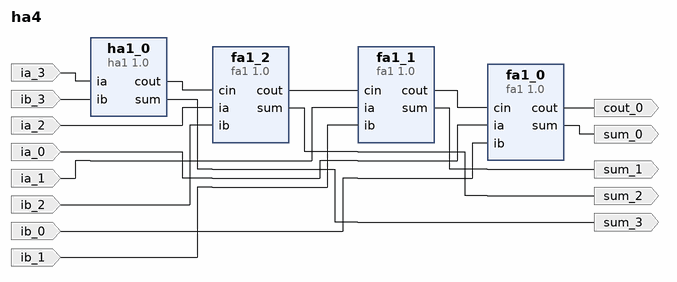
[diagram p0: block diagram of the top level]
# Vivado block design ha4, xc7z020clg484-2, Vivado 2024.1
create_bd_design ha4

create_bd_port -dir O sum_0
create_bd_port -dir O cout_0
create_bd_port -dir I ia_0
create_bd_port -dir I ib_0
create_bd_port -dir I ia_1
create_bd_port -dir I ib_1
create_bd_port -dir O sum_1
create_bd_port -dir I ia_2
create_bd_port -dir I ib_2
create_bd_port -dir O sum_2
create_bd_port -dir I ia_3
create_bd_port -dir I ib_3
create_bd_port -dir O sum_3

create_bd_cell -type ip -vlnv xilinx.com:user:fa1:1.0 fa1_0
create_bd_cell -type ip -vlnv xilinx.com:user:ha1:1.0 ha1_0
create_bd_cell -type ip -vlnv xilinx.com:user:fa1:1.0 fa1_1
create_bd_cell -type ip -vlnv xilinx.com:user:fa1:1.0 fa1_2

# ---- connections ----

connect_bd_net [get_bd_pins fa1_0/cout] [get_bd_ports cout_0]
connect_bd_net [get_bd_pins fa1_0/sum] [get_bd_ports sum_0]
connect_bd_net [get_bd_pins fa1_1/cout] [get_bd_pins fa1_0/cin]
connect_bd_net [get_bd_pins fa1_1/sum] [get_bd_ports sum_1]
connect_bd_net [get_bd_pins fa1_2/cout] [get_bd_pins fa1_1/cin]
connect_bd_net [get_bd_pins fa1_2/sum] [get_bd_ports sum_2]
connect_bd_net [get_bd_pins ha1_0/cout] [get_bd_pins fa1_2/cin]
connect_bd_net [get_bd_pins ha1_0/sum] [get_bd_ports sum_3]
connect_bd_net -net ia_0_1 [get_bd_ports ia_0] [get_bd_pins fa1_0/ia]
connect_bd_net -net ia_1_1 [get_bd_ports ia_1] [get_bd_pins fa1_1/ia]
connect_bd_net -net ia_2_1 [get_bd_ports ia_2] [get_bd_pins fa1_2/ia]
connect_bd_net -net ia_3_1 [get_bd_ports ia_3] [get_bd_pins ha1_0/ia]
connect_bd_net -net ib_0_1 [get_bd_ports ib_0] [get_bd_pins fa1_0/ib]
connect_bd_net -net ib_1_1 [get_bd_ports ib_1] [get_bd_pins fa1_1/ib]
connect_bd_net -net ib_2_1 [get_bd_ports ib_2] [get_bd_pins fa1_2/ib]
connect_bd_net -net ib_3_1 [get_bd_ports ib_3] [get_bd_pins ha1_0/ib]

validate_bd_design
save_bd_design
